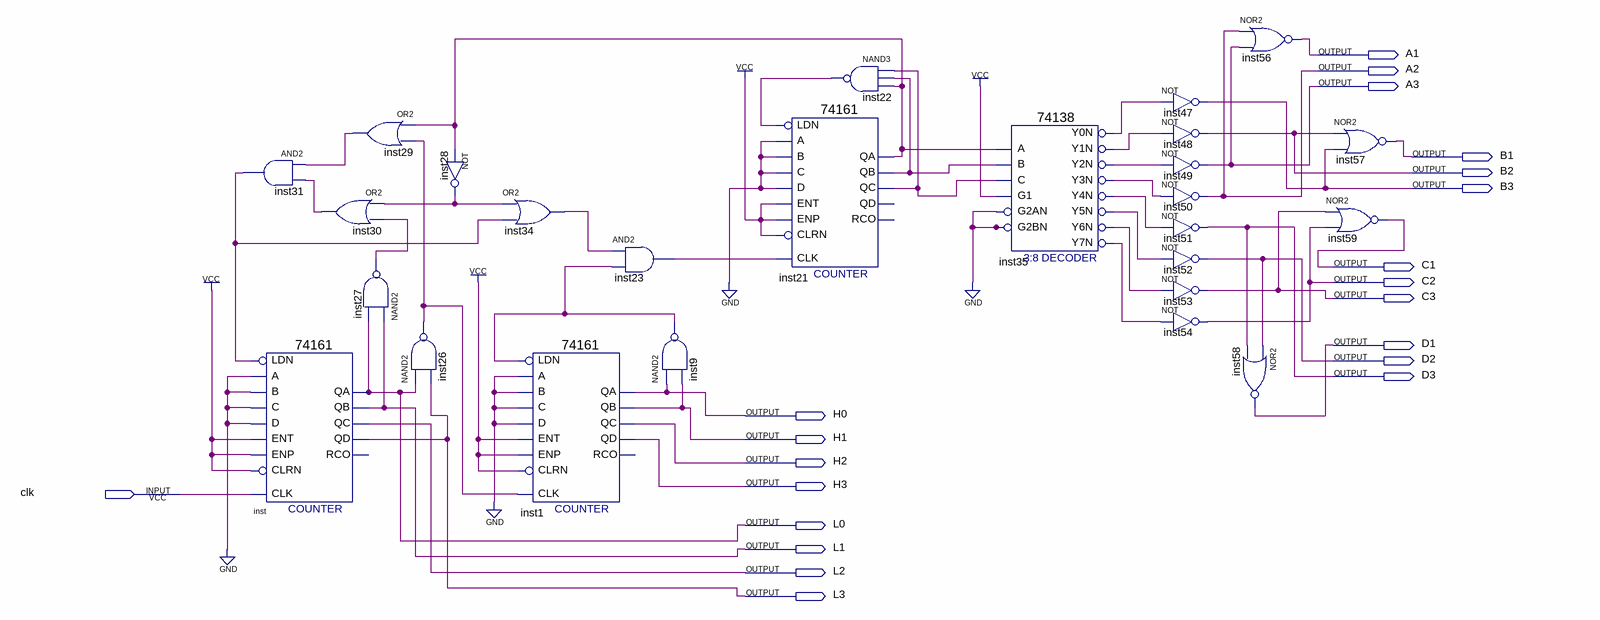
[diagram p0: schematic sheet]
// Quartus schematic translight.bdf as structural Verilog: 26 symbols, 21 pins
module translight (
  input  clk,
  output A1,
  output A2,
  output A3,
  output B1,
  output B2,
  output B3,
  output C1,
  output C2,
  output C3,
  output D1,
  output D2,
  output D3,
  output H0,
  output H1,
  output H2,
  output H3,
  output L0,
  output L1,
  output L2,
  output L3
);

  wire inst9_out, inst21_qa, inst21_qb, inst21_qc, inst22_out, inst23_out, inst26_out, inst27_out,
       inst28_out, inst29_out, inst30_out, inst31_out, inst34_out, inst35_y0n, inst35_y1n, inst35_y2n,
       inst35_y3n, inst35_y4n, inst35_y5n, inst35_y6n, inst35_y7n;

  and inst31 (inst31_out, inst29_out, inst30_out);
  \74161  inst (
    .CLRN(1'b1), .CLK(clk), .ENP(1'b1), .LDN(inst31_out), .A(1'b0), .D(1'b0), .ENT(1'b1), .B(1'b0), .C(1'b0),
    .QD(L3), .QC(L2), .QB(L1), .QA(L0));  // open: RCO
  or inst30 (inst30_out, inst28_out, inst27_out);
  or inst29 (inst29_out, inst21_qa, inst26_out);
  nand inst27 (inst27_out, L1, L0);
  not inst28 (inst28_out, inst21_qa);
  nand inst26 (inst26_out, L0, L3);
  or inst34 (inst34_out, inst28_out, inst31_out);
  \74161  inst1 (
    .CLRN(1'b1), .CLK(inst26_out), .ENP(1'b1), .LDN(inst9_out), .A(1'b0), .D(1'b0), .ENT(1'b1), .B(1'b0),
    .C(1'b0), .QD(H3), .QC(H2), .QB(H1), .QA(H0));  // open: RCO
  and inst23 (inst23_out, inst34_out, inst9_out);
  nand inst9 (inst9_out, H0, H1);
  nand inst22 (inst22_out, inst21_qc, inst21_qb, inst21_qa);
  \74161  inst21 (
    .CLRN(1'b1), .CLK(inst23_out), .ENP(1'b1), .LDN(inst22_out), .A(1'b0), .D(1'b0), .ENT(1'b1), .B(1'b0),
    .C(1'b0), .QC(inst21_qc), .QB(inst21_qb), .QA(inst21_qa));  // open: QD, RCO
  \74138  inst35 (
    .A(inst21_qa), .B(inst21_qb), .G1(1'b1), .C(inst21_qc), .G2AN(1'b0), .G2BN(1'b0), .Y0N(inst35_y0n),
    .Y1N(inst35_y1n), .Y2N(inst35_y2n), .Y3N(inst35_y3n), .Y4N(inst35_y4n), .Y5N(inst35_y5n),
    .Y6N(inst35_y6n), .Y7N(inst35_y7n));
  not inst47 (B3, inst35_y0n);
  not inst48 (B2, inst35_y1n);
  not inst49 (A3, inst35_y2n);
  not inst50 (A2, inst35_y3n);
  not inst51 (D3, inst35_y4n);
  not inst52 (D2, inst35_y5n);
  not inst53 (C3, inst35_y6n);
  not inst54 (C2, inst35_y7n);
  nor inst56 (A1, A2, A3);
  nor inst58 (D1, D2, D3);
  nor inst57 (B1, B2, B3);
  nor inst59 (C1, C3, C2);
endmodule
